# Altium schematic sheet RVT100UF35V67RV00341_RVT100UF35V67RV0034.schdoc
size 127 x 99 mm
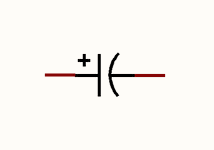
[diagram p0: RVT100UF35V67RV00341_RVT100UF35V67RV0034.schdoc]

## Parts
C?  100uF  [CAP-SMD_BD6.3-L6.6-W6.6-LS7.4-FD]  (value not drawn)

## Nets

Not connected (* = marked no-connect by the designer): C? 1 2

## Library data of the parts
C? = RVT100UF35V67RV0034: Manufacturer: KNSCHA(科尼盛); Add into BOM: yes; Tolerance: ±20%; Rated Voltage: 35V; Ripple Current: 87mA@120kHz; φD: 6.3mm; L: 7.7mm; Lifetime @ Temp: 2000hrs@105℃; Symbol: RVT100UF35V67RV0034; Device: RVT100UF35V67RV0034; LCSC Part Name: 100uF ±20% 35V; Supplier Part: C2836442; Manufacturer Part: RVT100UF35V67RV0034; Supplier Footprint: SMD,D6.3xL7.7mm; JLCPCB Part Class: Extended Part; Datasheet: https://atta.szlcsc.com/upload/public/pdf/source/20210528/C2836442_7F6389BF36F63F32D6DF3A507E8E95D6.pdf; Supplier: LCSC; Convert to PCB: yes; Value: 100uF; Equivalent Series Resistance(ESR): -; Operating Temperature: -55℃~+105℃